# EAGLE schematic fonte1 (EAGLE 9.6.2)
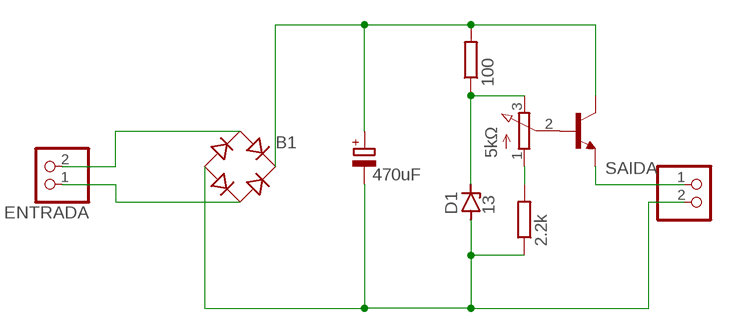
[diagram p0: schematic, sheet 1]

## Parts
B1  RB1A  [RB1A]
C1  470uF  CPOL-EUE2,5-6E  [E2,5-6E]
D1  13  ZENER-DIODEDO41Z10  [DO41Z10]
ENTRADA  PINHD-1X2  [1X02]
R2  5kΩ  3RP/1610N  [3RP/1610N]
R3  2.2k  R-EU_0207/10  [0207/10]
R4  100  R-EU_0207/10  [0207/10]
SAIDA  PINHD-1X2  [1X02]
T1  2N706  [TO18]

## Nets
N$1: B1.AC1 ENTRADA.2
N$2: B1.- C1.- D1.A R3.1 SAIDA.2
N$3: B1.AC2 ENTRADA.1
N$4: R2.2(S) T1.2(B)
N$5: R2.1(A) R3.2
N$6: SAIDA.1 T1.1(E)
N$7: D1.C R2.3(E) R4.1
N$8: B1.+ C1.+ R4.2 T1.3(C)

## Library data of the parts
B1 = rectifier:RB1A: RECTIFIER 1 A
C1 = rcl:CPOL-EU: POLARIZED CAPACITOR, European symbol; SPICEPREFIX: C
D1 = diode:ZENER-DIODE: Z-Diode
ENTRADA SAIDA = pinhead:PINHD-1X2: PIN HEADER
R2 = pot:3RP/1610N: 16mm Potentiometer one level Source: http://www.alphapotentiometers.net/html/16mm_pot_2.html
R3 R4 = rcl:R-EU_: RESISTOR, European symbol; SPICEPREFIX: R
T1 = transistor:2N706: NPN TRANSISTOR